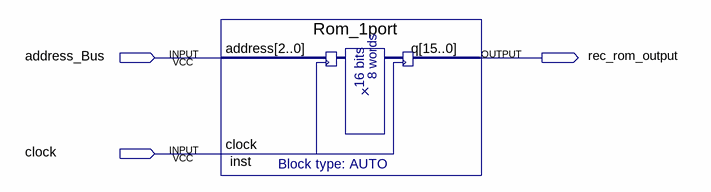
[diagram p0: schematic sheet]
// Quartus schematic Rom_tanh.bdf as structural Verilog: 1 symbols, 3 pins
module Rom_tanh (
  input  address_Bus,
  input  clock,
  output rec_rom_output
);

  Rom_1port inst (.address({3{address_Bus}}), .clock(clock), .q(rec_rom_output));
endmodule
